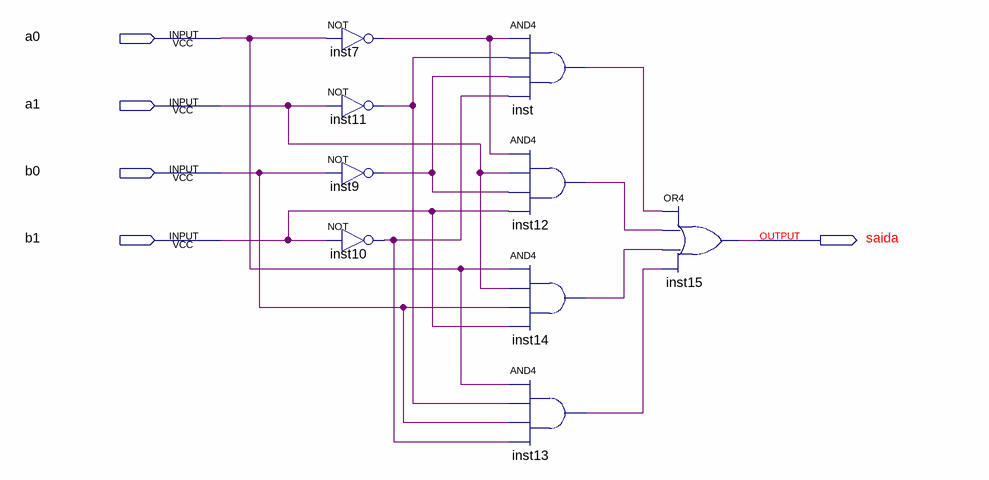
[diagram p0: schematic sheet]
// Quartus schematic AigualB.bdf as structural Verilog: 9 symbols, 5 pins
module AigualB (
  input  a0,
  input  a1,
  input  b0,
  input  b1,
  output saida
);

  wire inst7_out, inst9_out, inst10_out, inst11_out, inst12_out, inst13_out, inst14_out, inst_out;

  not inst7 (inst7_out, a0);
  not inst11 (inst11_out, a1);
  not inst9 (inst9_out, b0);
  not inst10 (inst10_out, b1);
  and inst (inst_out, inst7_out, inst11_out, inst9_out, inst10_out);
  and inst12 (inst12_out, inst7_out, a1, inst9_out, b1);
  and inst14 (inst14_out, a0, a1, b0, b1);
  and inst13 (inst13_out, a0, inst11_out, b0, inst10_out);
  or inst15 (saida, inst_out, inst12_out, inst14_out, inst13_out);
endmodule
